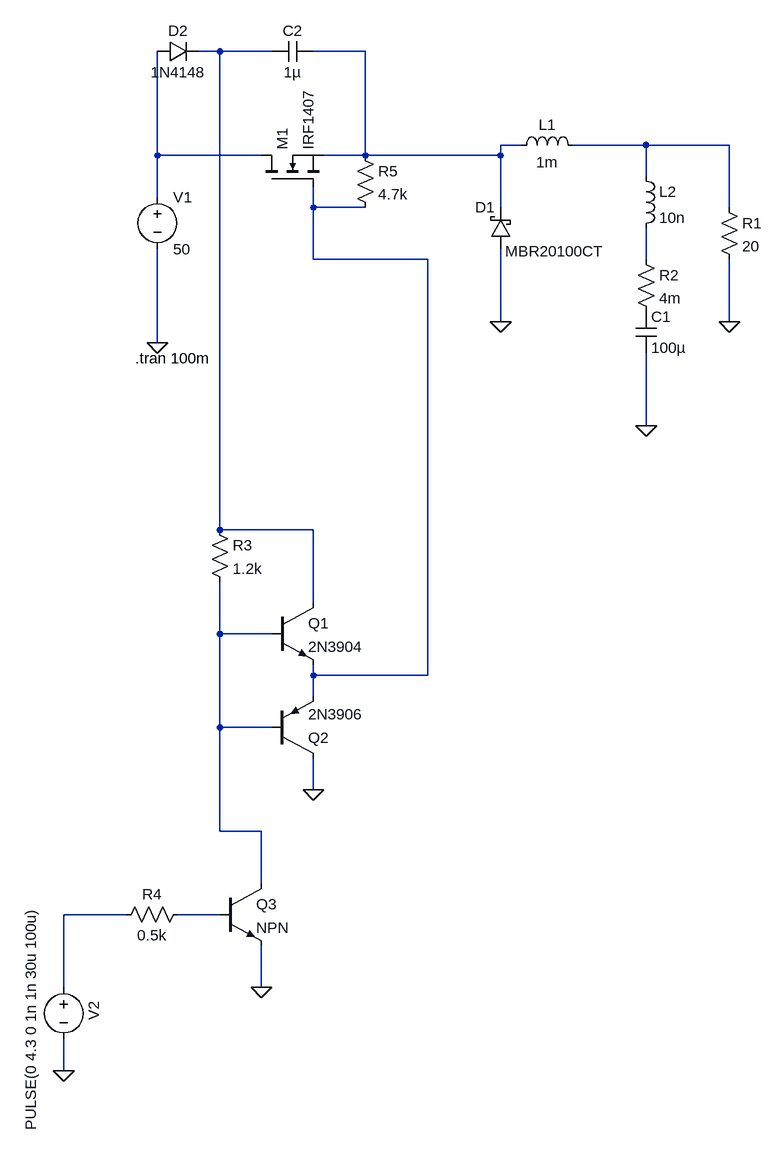
[diagram p0: schematic Draft1.asc]
Draft1.asc, the LTspice schematic file:
Version 4
SHEET 1 880 1592
WIRE -128 -80 -160 -80
WIRE -48 -80 -128 -80
WIRE 96 -80 16 -80
WIRE 336 64 304 64
WIRE 528 64 416 64
WIRE 656 64 528 64
WIRE -224 80 -224 -80
WIRE -64 80 -224 80
WIRE 96 80 96 -80
WIRE 96 80 32 80
WIRE 304 80 304 64
WIRE 304 80 96 80
WIRE 528 112 528 64
WIRE -224 144 -224 80
WIRE 16 160 16 128
WIRE 96 160 16 160
WIRE 304 160 304 80
WIRE 656 160 656 64
WIRE 16 240 16 160
WIRE 192 240 16 240
WIRE 528 240 528 192
WIRE 304 336 304 224
WIRE 656 336 656 240
WIRE -224 368 -224 224
WIRE 528 496 528 384
WIRE -128 656 -128 -80
WIRE 16 656 -128 656
WIRE 16 768 16 656
WIRE -128 816 -128 736
WIRE -48 816 -128 816
WIRE 16 880 16 864
WIRE 192 880 192 240
WIRE 192 880 16 880
WIRE 16 912 16 880
WIRE -128 960 -128 816
WIRE -48 960 -128 960
WIRE 16 1056 16 1008
WIRE -128 1120 -128 960
WIRE -64 1120 -128 1120
WIRE -64 1200 -64 1120
WIRE -272 1248 -368 1248
WIRE -128 1248 -192 1248
WIRE -368 1360 -368 1248
WIRE -64 1360 -64 1296
WIRE -368 1488 -368 1440
FLAG -224 368 0
FLAG 304 336 0
FLAG 528 496 0
FLAG 656 336 0
FLAG -368 1488 0
FLAG 16 1056 0
FLAG -64 1360 0
SYMBOL voltage -224 128 R0
WINDOW 123 0 0 Left 0
WINDOW 39 0 0 Left 0
SYMATTR InstName V1
SYMATTR Value 50
SYMBOL nmos -64 128 R270
SYMATTR InstName M1
SYMATTR Value IRF1407
SYMBOL ind 320 80 R270
WINDOW 0 32 56 VTop 2
WINDOW 3 5 56 VBottom 2
SYMATTR InstName L1
SYMATTR Value 1m
SYMBOL res 640 144 R0
SYMATTR InstName R1
SYMATTR Value 20
SYMBOL cap 512 320 R0
SYMATTR InstName C1
SYMATTR Value 100µ
SYMBOL voltage -368 1344 R0
WINDOW 0 31 52 VTop 2
WINDOW 3 -35 64 VBottom 2
WINDOW 123 0 0 Left 0
WINDOW 39 0 0 Left 0
SYMATTR InstName V2
SYMATTR Value PULSE(0 4.3 0 1n 1n 30u 100u)
SYMBOL schottky 320 224 R180
WINDOW 0 24 64 Left 2
WINDOW 3 -144 -3 Left 2
SYMATTR InstName D1
SYMATTR Value MBR20100CT
SYMATTR Description Diode
SYMATTR Type diode
SYMBOL res 512 224 R0
SYMATTR InstName R2
SYMATTR Value 4m
SYMBOL ind 512 96 R0
SYMATTR InstName L2
SYMATTR Value 10n
SYMBOL res -176 1232 R90
WINDOW 0 0 56 VBottom 2
WINDOW 3 32 56 VTop 2
SYMATTR InstName R4
SYMATTR Value 0.5k
SYMBOL npn -48 768 R0
SYMATTR InstName Q1
SYMATTR Value 2N3904
SYMBOL pnp -48 1008 M180
SYMATTR InstName Q2
SYMATTR Value 2N3906
SYMBOL cap 16 -96 R90
WINDOW 0 0 32 VBottom 2
WINDOW 3 32 32 VTop 2
SYMATTR InstName C2
SYMATTR Value 1µ
SYMBOL diode -224 -64 R270
WINDOW 0 32 32 VTop 2
WINDOW 3 0 32 VBottom 2
SYMATTR InstName D2
SYMATTR Value 1N4148
SYMBOL res -144 640 R0
SYMATTR InstName R3
SYMATTR Value 1.2k
SYMBOL npn -128 1200 R0
SYMATTR InstName Q3
SYMBOL res 80 64 R0
SYMATTR InstName R5
SYMATTR Value 4.7k
TEXT -258 392 Left 2 !.tran 100m

The netlist it stands for:
* Draft1.asc
V1 N004 0 50
M1 N004 N005 N002 N002 IRF1407
L1 N002 N003 1m
R1 N003 0 20
C1 P001 0 100µ
V2 N008 0 PULSE(0 4.3 0 1n 1n 30u 100u)
D1 0 N002 MBR20100CT
R2 N006 P001 4m
L2 N003 N006 10n
R4 N009 N008 0.5k
Q1 N001 N007 N005 0 2N3904
Q2 0 N007 N005 0 2N3906
C2 N002 N001 1µ
D2 N004 N001 1N4148
R3 N001 N007 1.2k
Q3 N007 N009 0 0 NPN
R5 N002 N005 4.7k
.model D D
.lib standard.dio
.model NPN NPN
.model PNP PNP
.lib standard.bjt
.model NMOS NMOS
.model PMOS PMOS
.lib standard.mos
.tran 100m
.backanno
.end